# EAGLE design Atlas (EAGLE 9.2.0)
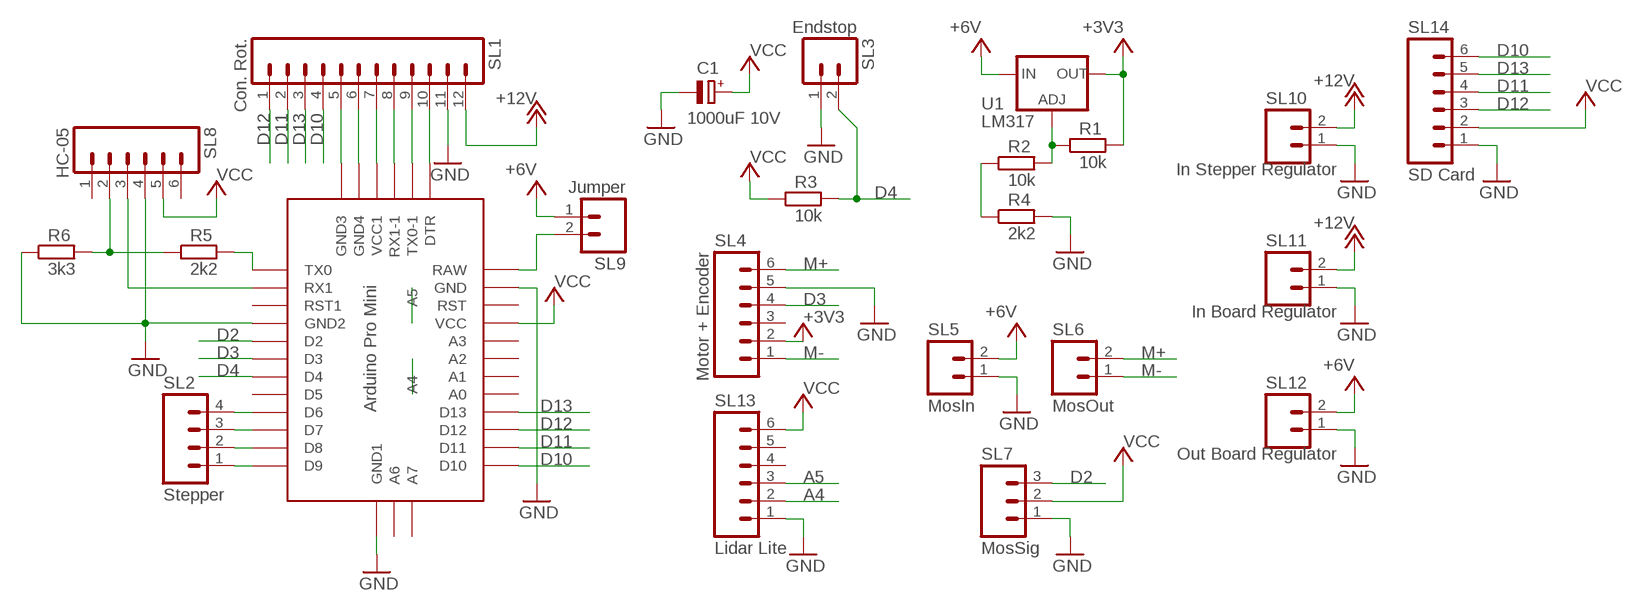
[diagram p0: schematic, sheet 1]

## Parts
C1  1000uF 10V  CPOL-EUE5-10.5  [E5-10,5]
R1  10k  R-EU_0207/10  [0207/10]
R2  10k  R-EU_0207/10  [0207/10]
R3  10k  R-EU_0207/10  [0207/10]
R4  2k2  R-EU_0207/10  [0207/10]
R5  2k2  R-EU_0207/10  [0207/10]
R6  3k3  R-EU_0207/10  [0207/10]
SL1  Con. Rot.  M12  [12P]
SL2  Stepper  M04  [04P]
SL3  Endstop  M02  [02P]
SL4  Motor + Encoder  M06  [06P]
SL5  MosIn  M02  [02P]
SL6  MosOut  M02  [02P]
SL7  MosSig  M03  [03P]
SL8  HC-05  M06  [06P]
SL9  Jumper  M02  [02P]
SL10  In Stepper Regulator  M02  [02P]
SL11  In Board Regulator  M02  [02P]
SL12  Out Board Regulator  M02  [02P]
SL13  Lidar Lite  M06  [06P]
SL14  SD Card  M06  [06P]
U1  LM317  V_REG_317SINK  [TO220-ADJ]
U$1  ABK-PRO-MINI  [ABK-PRO-MINI]

## Nets
+3V3: R1.2 SL4.2 U1.OUT
+6V: SL5.2 SL9.1 SL12.2 U1.IN
+12V: SL1.12 SL10.2 SL11.2
A4: SL13.2 U$1.A4
A5: SL13.3 U$1.A5
D2: SL7.3 U$1.D2
D3: SL4.4 U$1.D3
D4: R3.2 SL3.2 U$1.D4
D10: SL1.4 SL14.6 U$1.D10
D11: SL1.2 SL14.4 U$1.D11
D12: SL1.1 SL14.3 U$1.D12
D13: SL1.3 SL14.5 U$1.D13
GND: C1.- R4.2 R6.1 SL1.5 SL1.6 SL1.11 SL3.1 SL4.5 SL5.1 SL7.1 SL8.4 SL10.1 SL11.1 SL12.1 SL13.1 SL14.1 U$1.GND U$1.GND1(GND2) U$1.GND2(GND3) U$1.GND3(GND4) U$1.GND4(GND1)
M+: SL4.6 SL6.2
M-: SL4.1 SL6.1
N$1: R5.2 U$1.TX0
N$2: SL9.2 U$1.RAW
N$4: SL1.8 U$1.RX1-1
N$5: SL1.9 U$1.TX0-1
N$6: SL1.10 U$1.DTR
N$7: R2.1 R4.1
N$8: R5.1 R6.2 SL8.2
N$9: R1.1 R2.2 U1.ADJ
N$10: SL8.3 U$1.RX1
N$12: SL2.1 U$1.D9
N$13: SL2.2 U$1.D8
N$14: SL2.3 U$1.D7
N$15: SL2.4 U$1.D6
VCC: C1.+ R3.1 SL1.7 SL7.2 SL8.5 SL13.6 SL14.2 U$1.VCC U$1.VCC1
Unconnected: SL4.3 SL8.1 SL8.6 SL13.4 SL13.5 U$1.A0 U$1.A1 U$1.A2 U$1.A3 U$1.A6 U$1.A7 U$1.D5 U$1.RST U$1.RST1

## Library data of the parts
C1 = resistor:CPOL-EU: POLARIZED CAPACITOR, European symbol
R1-R6 = resistor:R-EU_: RESISTOR, European symbol
SL1 = con-amp-quick:M12: AMP QUICK CONNECTOR; OC_FARNELL: unknown; OC_NEWARK: unknown
SL2 = con-amp-quick:M04: AMP QUICK CONNECTOR; OC_FARNELL: unknown; OC_NEWARK: unknown
SL3 SL5 SL6 SL9-SL12 = con-amp-quick:M02: AMP QUICK CONNECTOR; OC_FARNELL: unknown; OC_NEWARK: unknown
SL4 SL8 SL13 SL14 = con-amp-quick:M06: AMP QUICK CONNECTOR; OC_FARNELL: unknown; OC_NEWARK: unknown
SL7 = con-amp-quick:M03: AMP QUICK CONNECTOR; OC_FARNELL: unknown; OC_NEWARK: unknown
U1 = SparkFun-IC-Power:V_REG_317: Voltage Regulator Standard LM317 adjustable voltage regulator. AOI (Adjust Output Input). Google 'LM317 Calculator' for easy to use app to get the two resistor values needed. 240/720 for 5V output. 240/390 for 3.3V output. Spark Fun Electronics SKU : COM-00527
U$1 = Arduino:ABK-PRO-MINI: ABK Pro-Mini Arduino Clone

## Board
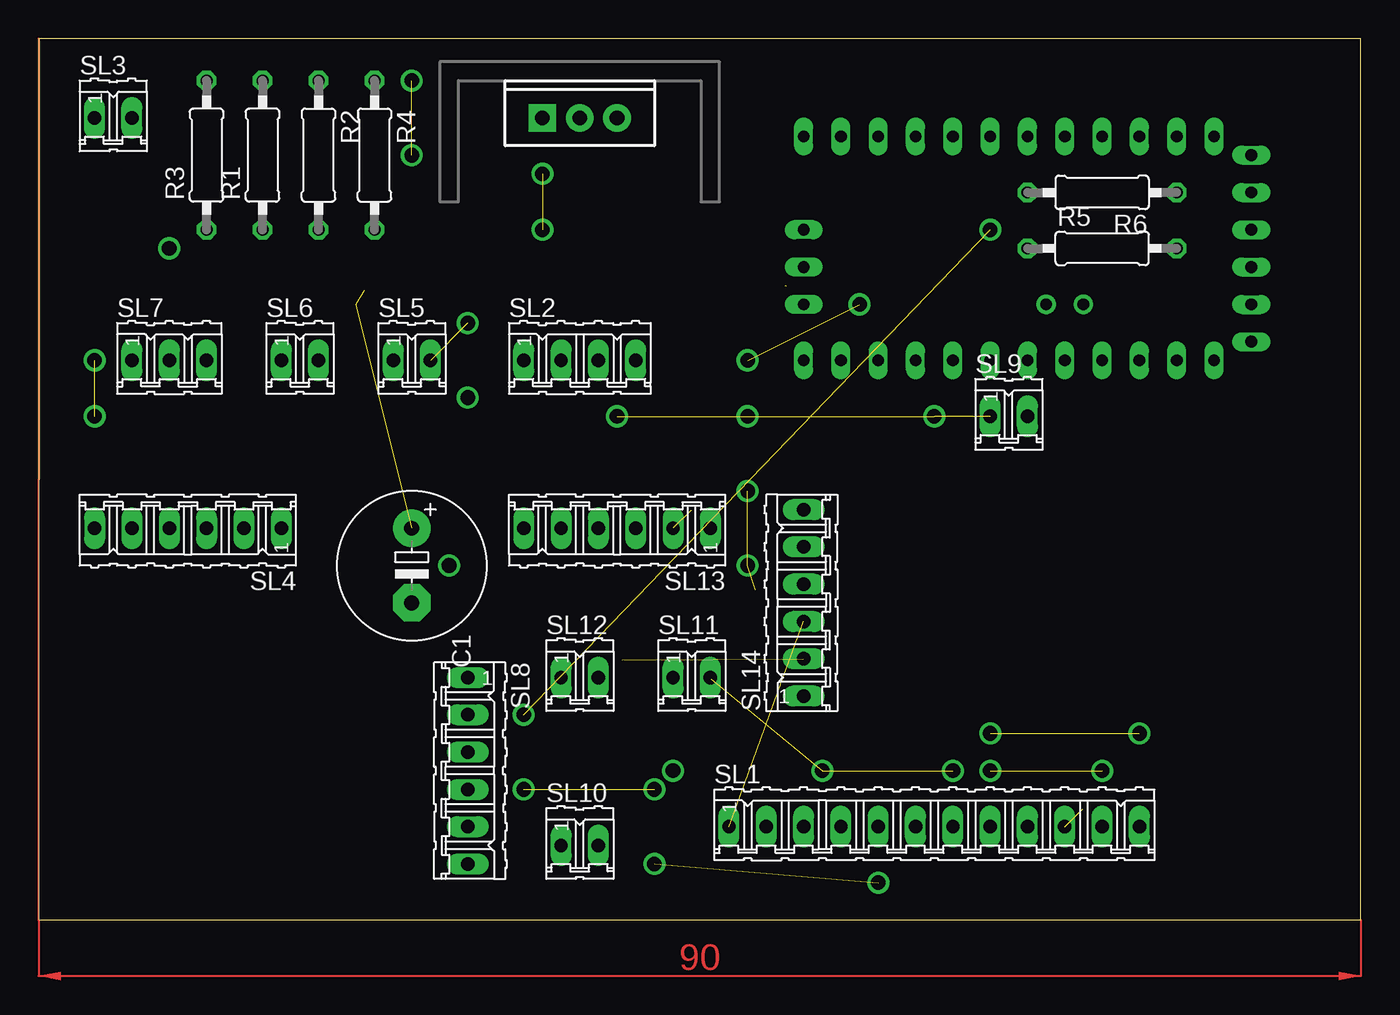
[diagram p1: board, top side]
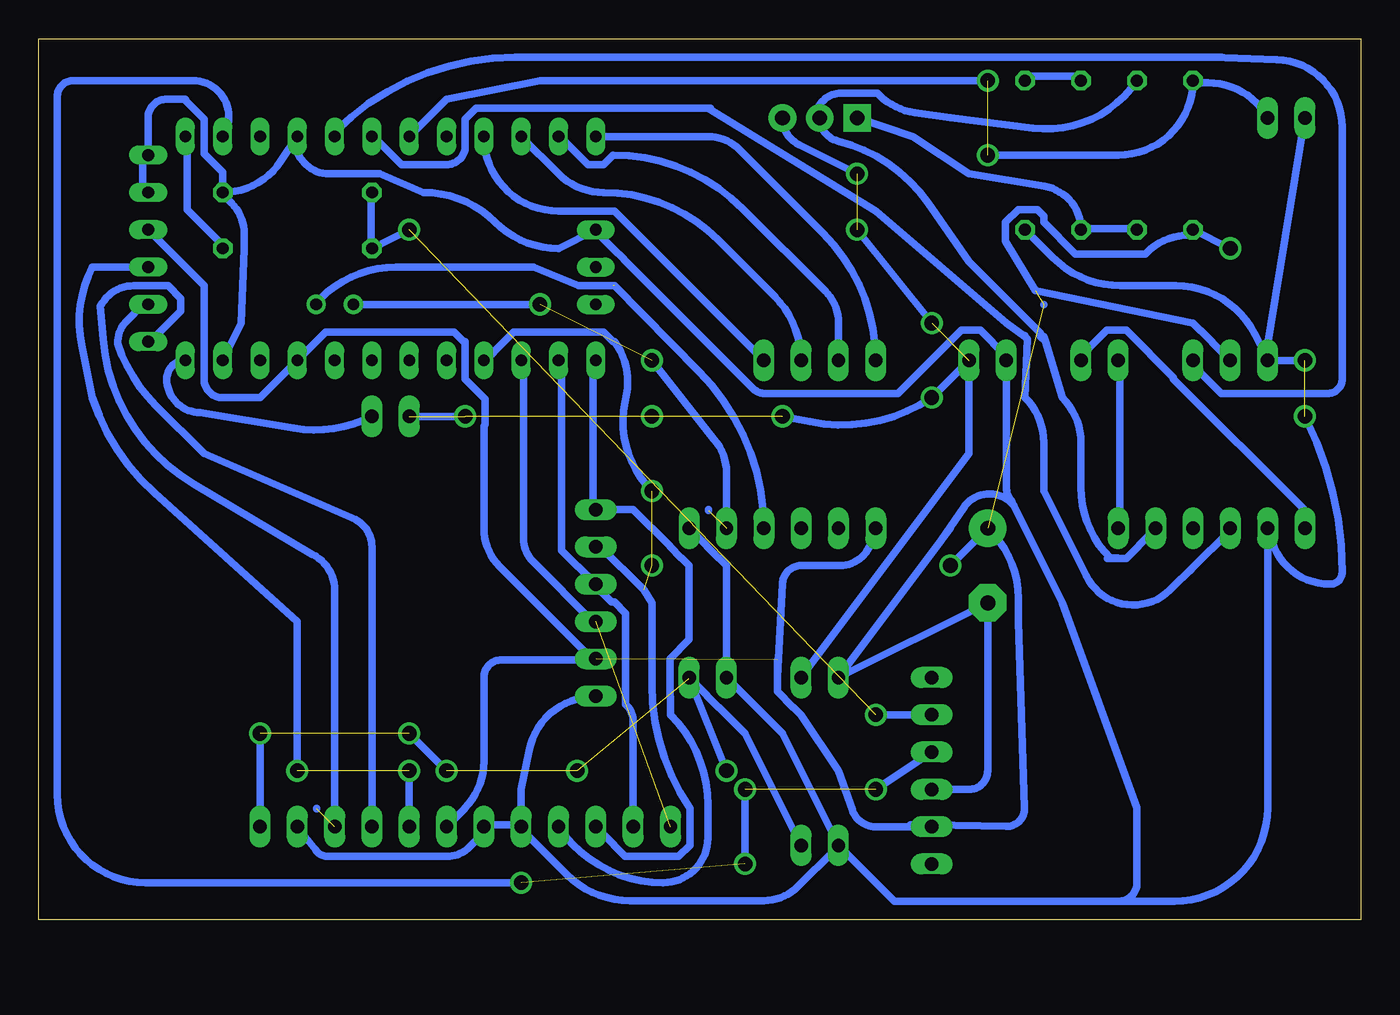
[diagram p2: board, bottom side, seen from below]

Size 90 x 60 mm. Coordinates in mm from the lower left corner, seen from the top.
Outline: 0,0 90,0 90,60 0,60 0,0
Copper layers (1*16): Top 0.035mm / dielectric 1.5mm / Bottom 0.035mm
Design rules "default *": minimum track width 20mil, minimum drill 0.35mm, track to track 14mil, track to pad 14mil, pad to pad 10mil, via to via 10mil, smd to smd 10mil, copper to edge 40mil, drill to drill 6mil, minimum pad ring 10mil, minimum via ring 8mil, stop-mask expansion 4mil, vias tented up to drill 0mil, thermal gap 10mil

### Footprints (pad centres in the part's own frame; a part is rotated, then mirrored left to right if it is on the bottom)
E5-10,5 = drill 1.016 pad 2.54: + -2.54,0 | drill 1.016 pad 2.54 octagon: - 2.54,0
0207/10 = drill 0.813 octagon: 1 -5.08,0; 2 5.08,0
12P = drill 0.914 long: 1 -13.97,0; 2 -11.43,0; 3 -8.89,0; 4 -6.35,0; 5 -3.81,0; 6 -1.27,0; 7 1.27,0; 8 3.81,0; 9 6.35,0; 10 8.89,0; 11 11.43,0; 12 13.97,0
04P = drill 0.914 long: 1 -3.81,0; 2 -1.27,0; 3 1.27,0; 4 3.81,0
02P = drill 0.914 long: 1 -1.27,0; 2 1.27,0
06P = drill 0.914 long: 1 -6.35,0; 2 -3.81,0; 3 -1.27,0; 4 1.27,0; 5 3.81,0; 6 6.35,0
03P = drill 0.914 long: 1 -2.54,0; 2 0,0; 3 2.54,0
TO220-ADJ = drill 1 pad 1.88 square: ADJ -2.54,0 | drill 1 pad 1.88: IN 2.54,0; OUT 0,0
ABK-PRO-MINI = drill 0.8 long: A0 10.16,-3.81; A1 10.16,-6.35; A2 10.16,-8.89; A3 10.16,-11.43; A6 3.81,-21.59; A7 6.35,-21.59; D2 -5.08,-3.81; D3 -5.08,-6.35; D4 -5.08,-8.89; D5 -5.08,-11.43; D6 -5.08,-13.97; D7 -5.08,-16.51; D8 -5.08,-19.05; D9 -5.08,-21.59; D10 10.16,-21.59; D11 10.16,-19.05; D12 10.16,-16.51; D13 10.16,-13.97; DTR 8.89,8.89; GND 10.16,3.81; GND1 -5.08,-1.27; GND2 -3.81,8.89; GND3 -1.27,8.89; GND4 1.27,-21.59; RAW 10.16,6.35; RST 10.16,1.27; RST1 -5.08,1.27; RX1 -5.08,3.81; RX1-1 3.81,8.89; TX0 -5.08,6.35; TX0-1 6.35,8.89; VCC 10.16,-1.27; VCC1 1.27,8.89 | drill 0.8: A4 6.35,-5.08; A5 6.35,-2.54

### Placement (x,y rotation side)
C1  25.4,24.13 270 top
R1  15.24,52.07 90 top
R2  19.05,52.07 270 top
R3  11.43,52.07 90 top
R4  22.86,52.07 270 top
R5  72.39,45.72 0 top
R6  72.39,49.53 180 top
SL1  60.96,6.35 0 top
SL2  36.83,38.1 0 top
SL3  5.08,54.61 0 top
SL4  10.16,26.67 180 top
SL5  25.4,38.1 0 top
SL6  17.78,38.1 0 top
SL7  8.89,38.1 0 top
SL8  29.21,10.16 270 top
SL9  66.04,34.29 0 top
SL10  36.83,5.08 0 top
SL11  44.45,16.51 0 top
SL12  36.83,16.51 0 top
SL13  39.37,26.67 180 top
SL14  52.07,21.59 90 top
U1  36.83,54.61 0 top
U$1  73.66,48.26 270 top

### Tracks (layer width: path | path; a pad name or v marks a point on that pad's centre or on a via)
+3V3
  Bottom 0.508: 15.54,57 R1.2 arc63 22.32,53.91 27.94,54.61 30.36,54.95 arc37 32.77,56.16 | U1.OUT 37.13,54.84 arc78 35.35,56.29 32.89,56.29 32.77,56.16 | 16.51,24.61 15.98,24.61 14.25,26.34 SL4.2 | 16.51,24.61 17.27,24.61 | 37.13,54.41 U1.OUT | 21.49,39.4 20.32,35.56 arc45 19.05,32.49 19.05,29.45 arc-45 17.06,24.64 16.54,24.64 16.51,24.61 | 21.49,39.4 21.59,39.73 | U1.OUT arc-76 35.6,53.03 arc41 29.48,48.82 26.67,44.81 21.82,39.95 21.82,39.73 21.49,39.4 | 32.77,56.16
+6V  (via drill 1)  (5 unrouted)
  Bottom 0.508: 38,16.84 SL12.2 26.67,31.75 SL5.2 v29.21,35.56 arc45 37.51,33.92 v39.37,34.29 | v34.29,50.8 38.23,52.77 arc63 U1.IN | v29.21,40.64 v34.29,46.99 | SL9.1 v60.96,34.29
  other vias: 48.26,34.29
+12V  (via drill 1)  (3 unrouted)
  Bottom 0.508: 38.43,5.18 SL10.2 41.91,12.7 43.69,14.48 43.73,14.48 44.5,15.25 44.5,15.29 SL11.2 | 45.77,16.41 SL11.2 | v74.93,12.7 SL1.12 | v64.77,12.7 v62.23,10.16 | SL11.2 v43.18,10.16
  other vias: 53.34,10.16
A4  (via drill 1)  (2 unrouted)
  Bottom 0.508: U$1.A4 68.22,41.88 55.91,41.88 v55.88,41.91 | 44.4,27.93 44.4,27.89 | SL13.2 43.18,30.48 arc-41 44.02,32.71 v48.26,38.1
A5  (1 unrouted)
  Bottom 0.508: U$1.A5 70.81,42.32 arc45 65.66,44.45 56.3,44.45 53.25,43.19 52.08,43.19 52.06,43.17 50.89,43.17 | 41.02,26.77 SL13.3 arc-45 45.06,37.34 50.8,43.18 50.81,43.19
D2
  Bottom 0.508: 9.46,58.73 10.16,58.73 | 10.16,58.73 57.59,58.73 arc-45 69.85,53.65 U$1.D2 69.52,53.54 | SL7.3 11.66,38 9.5,35.84 2.26,35.84 arc-90 1.27,36.83 1.27,53.98 arc-88 5.71,58.57 10.16,58.73
D3
  Bottom 0.508: 11.35,24.05 9.07,26.34 SL4.4 | 11.35,24.05 11.66,23.75 | 66.93,53.54 U$1.D3 67.21,53.34 65.29,51.42 62.23,51.42 arc-90 60.97,52.69 60.97,54.51 60.21,55.26 44.45,55.26 | 11.35,24.05 13,22.45 arc108 18.7,23.42 21.59,29.21 21.59,32.49 arc-45 22.86,35.56 22.7,39.53 22.86,39.7 | 44.26,55.27 44.27,55.26 44.45,55.26 | 22.86,39.7 22.86,39.77 | 22.86,39.7 24.13,40.64 33.02,48.26 44.45,55.26
D4  (via drill 1)  (1 unrouted)
  Bottom 0.508: SL3.2 arc-61 10.41,57 11.23,57 R3.2 arc90 16.51,52.07 v25.4,52.07 | U$1.D4 62.23,55.88 55.88,57.15 v25.4,57.15
D10
  Bottom 0.508: U$1.D10 52.25,38 52.25,28.07 SL14.6 | 54.41,6.04 SL1.4 arc-56 47.49,2.54 arc-90 44.45,5.58 44.45,7.84 arc-45 46.99,13.97 46.99,15.2 47.04,15.25 47.04,17.77 45.72,19.09 45.72,24.13 46.23,24.64 46.27,24.64 47.04,25.41 47.04,25.45 49.53,27.94 SL14.6 | 51.82,28.07 SL14.6
D11
  Bottom 0.508: U$1.D11 54.41,38 54.41,25.16 53.33,24.08 53.29,24.08 SL14.4 | SL14.4 52.25,22.89 51,21.64 50.81,21.64 50.04,20.87 50.04,14.69 arc45 49.53,13.47 SL1.2 49.66,6.48 | 51.82,22.89 SL14.4
D12  (1 unrouted)
  Bottom 0.508: U$1.D12 57,38 57,25.96 arc-45 56.35,24.4 52.25,20.3 SL14.3
D13  (via drill 1)  (2 unrouted)
  Bottom 0.508: 51.82,6.04 SL1.3 50.85,5.13 50.85,5.09 50.08,4.32 46.44,4.32 45.67,5.09 45.67,7.61 arc34 48.26,16.05 48.26,21.59 48.79,22.45 51.82,25.48 SL14.5 | U$1.D13 59.59,38.1 58.37,39.32 57.67,40.02 51.55,40.02 50.9,39.37 50.8,39.37 arc48 49.99,35.82 50.1,35.27 arc-56 v48.26,29.21
  other vias: 48.26,24.13
GND  (via drill 1)  (1 unrouted)
  Bottom 0.508: 52.25,15.11 SL14.1 arc-79 56.63,11.5 57.15,8.89 SL1.5 | SL1.5 57.43,6.48 59.59,6.48 SL1.6 59.59,6.04 60.67,4.96 arc45 62.23,4.32 70.25,4.32 arc52 71.16,4.76 SL1.11 72.11,6.04 | 35.84,5.18 SL10.1 | 43.18,16.41 SL11.1 | 45.34,26.34 SL13.1 44.5,25.45 44.5,25.41 43.73,24.64 43.69,24.64 43.18,24.13 SL11.1 | 43.18,16.84 SL11.1 | SL1.5 57,6.04 54.05,3.1 arc-45 49.76,1.32 40.64,1.32 arc-45 38.3,2.29 35.84,4.75 SL10.1 | 76,45.72 76,46.71 arc-45 76.86,48.79 77.29,49.23 R6.1 | 76,45.72 76,45.34 | U$1.GND 77.29,38.43 76.2,40.64 76,45.72 | 82.47,49.23 U$1.GND3 82.91,49.66 82.91,51.82 U$1.GND2 82.55,54.61 arc90 81.28,55.88 80.01,55.88 arc-45 79.94,55.71 78.73,54.51 78.73,52.16 77.47,50.9 R6.1 | 52.25,47.07 U$1.GND4 | 72.11,53.11 U$1.GND1 | U$1.GND1 72.54,53.11 arc-90 70.23,50.8 66.78,50.8 63.81,49.53 arc45 58.95,47.52 arc-45 54.61,45.72 U$1.GND4 | 29.36,9.07 SL8.4 26.67,8.89 arc-90 25.4,10.16 C1.- SL12.1 | 35.41,16.41 SL12.1 | 35.41,16.84 SL12.1 | 6.48,26.34 SL4.5 | 23.75,38 SL5.1 | U$1.GND4 51.82,46.63 50.9,45.71 50.89,45.71 50.15,44.97 41.33,36.14 arc-45 40.59,35.84 31.52,35.84 27.2,40.16 25.91,40.16 24.18,38.43 SL5.1 | 35.41,4.75 SL10.1 | 22.45,46.63 R4.2 20.95,45.09 arc-45 16.36,43.18 12.59,43.18 arc63 7.21,39.88 6.48,38.43 | 6.48,38.43 SL7.1 v3.81,38.1 | 3.89,54.11 3.89,54.41 SL3.1 6.48,38.43 | 23.6,28.2 20.32,21.59 15.24,7.62 15.24,2.54 arc90 16.51,1.27 | 23.6,28.2 23.75,28.5 arc45 24.13,29.42 SL5.1 | SL11.1 39.37,12.7 SL10.1 | SL10.1 31.75,1.27 16.51,1.27 | SL4.5 6.35,7.62 arc90 12.7,1.27 16.51,1.27 | SL12.1 28.55,25.86 | 28.55,25.86 27.94,26.67 | U$1.GND1 73.52,51.64 arc56 R6.1
  Bottom 0.508: 28.55,25.86 27.03,28.08 arc107 23.6,28.2 | 23.6,28.2 | v3.81,34.29 3.74,34.15 arc27 1.27,23.69 arc90 2.1,22.86 arc72 6.02,25.69 SL4.5
M+
  Bottom 0.508: SL4.6 3.89,26.77 3.89,27.64 3.89,27.98 12.75,36.84 12.75,36.92 15.98,40.15 17.29,40.15 19.05,38.38 SL6.2 19,38.43
M-
  Bottom 0.508: SL4.1 16.41,26.77 16.41,38 SL6.1
N$1
  Bottom 0.508: U$1.TX0 79.88,53.11 79.88,48.36 77.29,45.77 R5.2
N$2
  Bottom 0.508: 79.88,38 U$1.RAW arc-90 81.28,36.83 arc-90 78.99,34.54 72.65,33.49 arc-36 SL9.2 67.36,34.54
N$4  (via drill 1)  (1 unrouted)
  Bottom 0.508: v64.77,10.16 SL1.8 | v72.39,10.16 72.39,20.32 82.11,29.06 arc30 86.36,35.56 87.07,39.12 arc38 86.36,44.45 U$1.RX1-1
N$5
  Bottom 0.508: U$1.TX0-1 82.91,41.88 83.98,40.8 arc-45 84.63,39.24 arc-26 82.02,35.03 78.74,31.75 68.44,27.25 arc63 67.31,25.4 SL1.9 67.36,6.48
N$6  (1 unrouted)
  Bottom 0.508: 82.47,39.73 U$1.DTR 82.4,39.37 80.31,41.45 80.31,42.32 81.18,43.18 83.52,43.18 arc-63 85.79,41.78 85.61,39.56 arc-55 79.45,29.68 71.37,24.89 arc63 69.85,22.43 SL1.10 69.52,6.48 | 71.07,7.61 71.07,7.57
N$7
  Bottom 0.508: R2.1 19.43,57.43 22.45,57.43 R4.1
N$8  (via drill 1)  (1 unrouted)
  Bottom 0.508: R6.2 67.36,49.23 67.36,45.77 R5.1 v64.77,46.99 | SL8.2 v33.02,13.97
N$9
  Bottom 0.508: R1.1 15.54,47.07 19,47.07 R2.2 | 34.11,54.41 U1.ADJ 30.48,53.34 26.67,50.8 21.55,49.95 arc81 R2.2 | 19.43,47.07 R2.2
N$10  (via drill 1)  (2 unrouted)
  Bottom 0.508: SL8.3 v33.02,8.89 | v41.91,8.89 v41.91,3.81 | v57.15,2.54 82.73,2.54 arc90 88.73,8.54 88.73,56.05 arc90 87.63,57.15 79.51,57.15 arc124 U$1.RX1
N$12
  Bottom 0.508: 51.82,53.11 U$1.D9 44.45,53.34 arc45 42.28,52.44 36.61,46.77 arc45 SL2.1 33.25,38.43
N$13
  Bottom 0.508: 54.41,53.11 U$1.D8 54.51,53.34 52.59,51.42 51.55,51.42 50.9,52.07 arc45 42.06,48.41 36.46,42.81 arc45 35.56,40.64 SL2.2 35.84,38.43
N$14
  Bottom 0.508: 38,38.43 SL2.3 arc-45 39.9,42.44 43.77,46.31 arc-45 51.54,49.53 arc45 54.61,50.8 U$1.D7 56.72,52.7
N$15
  Bottom 0.508: 59.59,53.11 U$1.D6 arc-90 54.61,48.26 50.8,48.26 SL2.4 41.02,38.43
VCC  (via drill 1)  (3 unrouted)
  Bottom 0.508: 23.32,20.32 23.32,21.89 arc-47 C1.+ v27.94,24.13 | 23.32,20.32 23.32,20.03 | 28.93,6.48 SL8.5 | 39.73,16.51 39.73,15.56 arc-90 39.71,15.54 38.65,14.48 38.61,14.48 38.1,13.97 35.56,10.16 34.62,7.49 arc-71 33.02,6.35 SL8.5 | 39.73,16.51 39.73,17.7 | 29.36,6.48 30.66,6.48 | SL13.6 33.25,26.34 arc90 35.46,24.13 38.1,24.13 arc-90 39.37,22.86 39.73,16.51 | 29.36,6.48 SL8.5 | 9.07,38.43 SL7.2 10.11,39.32 10.11,39.36 10.88,40.13 10.92,40.13 11.43,40.64 22.15,42.84 24.18,46.2 24.18,47.5 23.32,48.36 22.02,48.36 21.59,47.93 21.59,47.5 19.43,45.34 14.68,45.34 14.61,45.41 arc45 11.66,46.63 R3.1 v8.89,45.72 | 52.25,17.7 SL14.2 | 62.18,6.48 SL1.7 61.01,7.57 61.01,7.61 arc-45 59.69,10.8 59.69,16.51 arc90 58.5,17.7 52.25,17.7 | U$1.VCC1 78.74,43.18 78.74,36.83 arc-90 77.47,35.56 74.93,35.56 U$1.VCC 70.47,40.02 61.71,40.02 61.06,39.37 60.96,39.37 60.96,36.83 59.6,35.47 59.6,33.73 59.69,33.64 59.69,26.67 arc-45 58.61,24.07 52.25,17.7 | 23.32,20.32 22.9,7.62 arc93 24.13,6.38 29.36,6.48 | 21.59,41.91
(copper drawn outside any net)
  shapes: Top area x2